# Altium schematic sheet Some.SchDoc
size A4
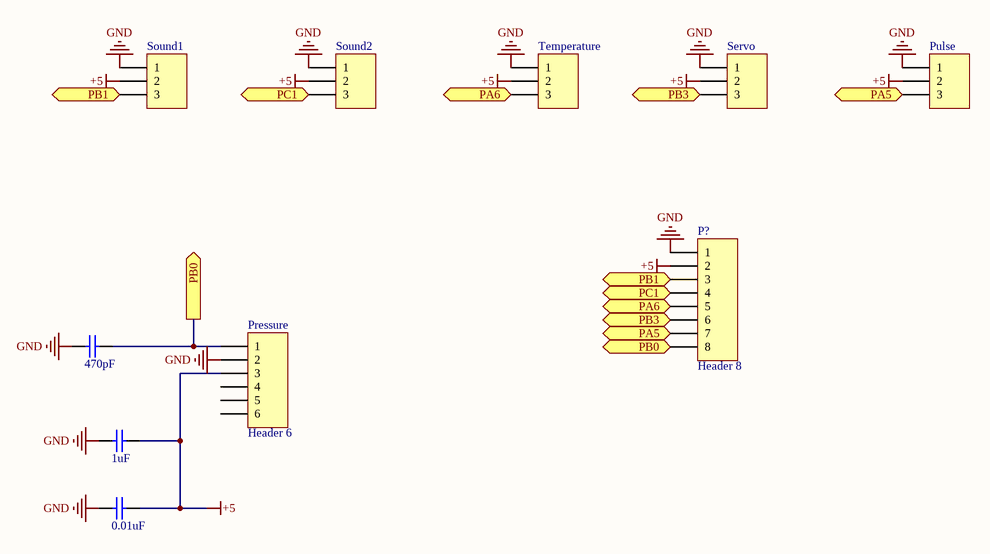
[diagram p0: Some.SchDoc]

## Parts
0.01uF  Cap  [My_cap100n]  (value not drawn)
1uF  Cap  [My_cap100n]  (value not drawn)
470pF  Cap  [My_cap100n]  (value not drawn)
P?  Header 8  [HDR1X8]
Pressure  Header 6  [HDR1X6]
Pulse  (no value)  [HDR1X3]
Servo  (no value)  [HDR1X3]
Sound1  (no value)  [HDR1X3]
Sound2  (no value)  [HDR1X3]
Temperature  (no value)  [HDR1X3]

## Ports
PA5 (in), PA5 (out), PA6 (in), PA6 (out), PB0 (in), PB0 (out), PB1 (in), PB1 (out), PB3 (in), PB3 (out), PC1 (in), PC1 (out)

## Nets
+5: 0.01uF.2 1uF.2 P?.2 Pressure.3 Pulse.2 Servo.2 Sound1.2 Sound2.2 Temperature.2
GND: 0.01uF.1 1uF.1 470pF.1 P?.1 Pressure.2 Pulse.1 Servo.1 Sound1.1 Sound2.1 Temperature.1
PA5: P?.7 Pulse.3 ; port PA5
PA6: P?.5 Temperature.3 ; port PA6
PB0: 470pF.2 P?.8 Pressure.1 ; port PB0
PB1: P?.3 Sound1.3 ; port PB1
PB3: P?.6 Servo.3 ; port PB3
PC1: P?.4 Sound2.3 ; port PC1

Not connected (* = marked no-connect by the designer): Pressure 4 5 6

## Library data of the parts
0.01uF 1uF 470pF = Cap ceramic: CAP-100Nf; Value: 100nF
P? = Header 8: Header, 8-Pin; LatestRevisionDate: 17-Jul-2002; LatestRevisionNote: Re-released for DXP Platform.; Publisher: Altium Limited
Pressure = Header 6: Header, 6-Pin; LatestRevisionDate: 17-Jul-2002; LatestRevisionNote: Re-released for DXP Platform.; Publisher: Altium Limited
Pulse Servo Sound1 Sound2 Temperature = Header 3: Header, 3-Pin; LatestRevisionDate: 17-Jul-2002; LatestRevisionNote: Re-released for DXP Platform.; Publisher: Altium Limited